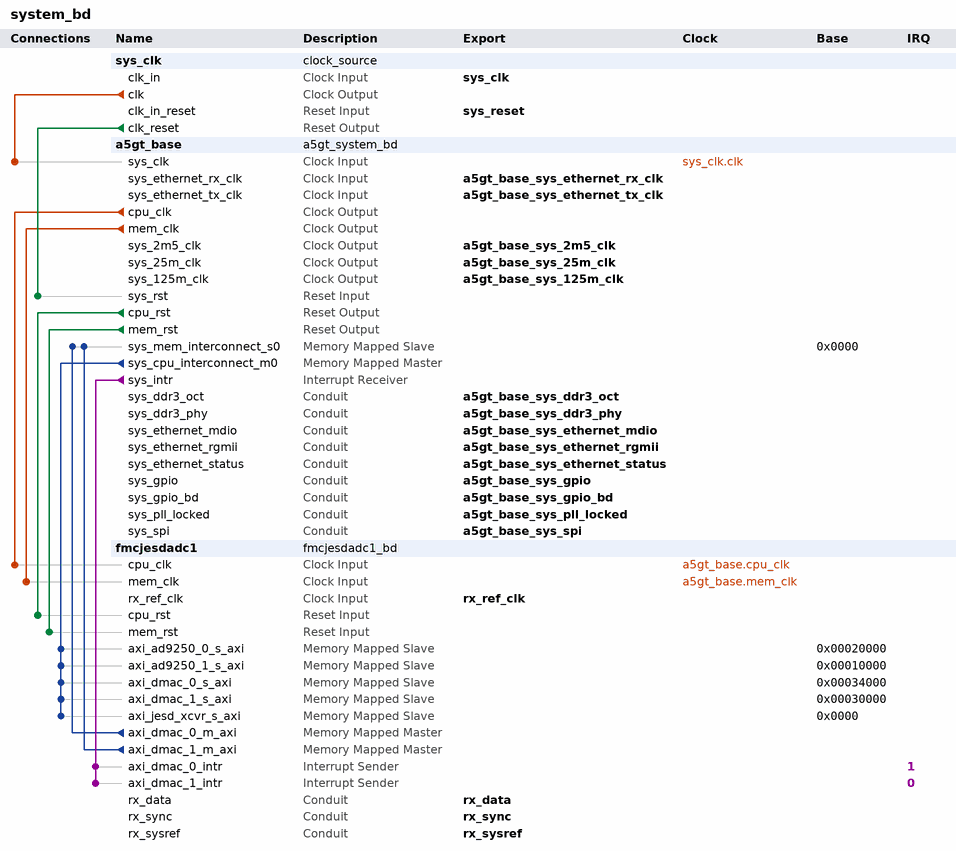
[diagram p0: system contents]
# Platform Designer (Qsys) system system_bd, Arria V 5AGTFD7K3F40I3
# Parameters at their usual value, and those the tool derives, are not listed.
package require -exact qsys 15.1
create_system system_bd
set_project_property DEVICE_FAMILY {Arria V}
set_project_property DEVICE 5AGTFD7K3F40I3

add_instance sys_clk clock_source 15.1
set_instance_parameter_value sys_clk clockFrequency 100000000

add_instance a5gt_base a5gt_system_bd 1.0

add_instance fmcjesdadc1 fmcjesdadc1_bd 1.0

# connections
add_connection a5gt_base.cpu_clk fmcjesdadc1.cpu_clk clock
add_connection a5gt_base.mem_clk fmcjesdadc1.mem_clk clock
add_connection sys_clk.clk a5gt_base.sys_clk clock
add_connection a5gt_base.cpu_rst fmcjesdadc1.cpu_rst reset
add_connection a5gt_base.mem_rst fmcjesdadc1.mem_rst reset
add_connection sys_clk.clk_reset a5gt_base.sys_rst reset
add_connection a5gt_base.sys_cpu_interconnect_m0 fmcjesdadc1.axi_ad9250_0_s_axi avalon
set_connection_parameter_value a5gt_base.sys_cpu_interconnect_m0/fmcjesdadc1.axi_ad9250_0_s_axi baseAddress 0x00020000
add_connection a5gt_base.sys_cpu_interconnect_m0 fmcjesdadc1.axi_ad9250_1_s_axi avalon
set_connection_parameter_value a5gt_base.sys_cpu_interconnect_m0/fmcjesdadc1.axi_ad9250_1_s_axi baseAddress 0x00010000
add_connection a5gt_base.sys_cpu_interconnect_m0 fmcjesdadc1.axi_dmac_0_s_axi avalon
set_connection_parameter_value a5gt_base.sys_cpu_interconnect_m0/fmcjesdadc1.axi_dmac_0_s_axi baseAddress 0x00034000
add_connection a5gt_base.sys_cpu_interconnect_m0 fmcjesdadc1.axi_dmac_1_s_axi avalon
set_connection_parameter_value a5gt_base.sys_cpu_interconnect_m0/fmcjesdadc1.axi_dmac_1_s_axi baseAddress 0x00030000
add_connection a5gt_base.sys_cpu_interconnect_m0 fmcjesdadc1.axi_jesd_xcvr_s_axi avalon
set_connection_parameter_value a5gt_base.sys_cpu_interconnect_m0/fmcjesdadc1.axi_jesd_xcvr_s_axi baseAddress 0x0000
add_connection fmcjesdadc1.axi_dmac_0_m_axi a5gt_base.sys_mem_interconnect_s0 avalon
set_connection_parameter_value fmcjesdadc1.axi_dmac_0_m_axi/a5gt_base.sys_mem_interconnect_s0 baseAddress 0x0000
add_connection fmcjesdadc1.axi_dmac_1_m_axi a5gt_base.sys_mem_interconnect_s0 avalon
set_connection_parameter_value fmcjesdadc1.axi_dmac_1_m_axi/a5gt_base.sys_mem_interconnect_s0 baseAddress 0x0000
add_connection a5gt_base.sys_intr fmcjesdadc1.axi_dmac_0_intr interrupt
set_connection_parameter_value a5gt_base.sys_intr/fmcjesdadc1.axi_dmac_0_intr irqNumber 1
add_connection a5gt_base.sys_intr fmcjesdadc1.axi_dmac_1_intr interrupt
set_connection_parameter_value a5gt_base.sys_intr/fmcjesdadc1.axi_dmac_1_intr irqNumber 0

# exported interfaces
add_interface a5gt_base_sys_125m_clk clock source
set_interface_property a5gt_base_sys_125m_clk EXPORT_OF a5gt_base.sys_125m_clk
add_interface a5gt_base_sys_25m_clk clock source
set_interface_property a5gt_base_sys_25m_clk EXPORT_OF a5gt_base.sys_25m_clk
add_interface a5gt_base_sys_2m5_clk clock source
set_interface_property a5gt_base_sys_2m5_clk EXPORT_OF a5gt_base.sys_2m5_clk
add_interface a5gt_base_sys_ddr3_oct conduit end
set_interface_property a5gt_base_sys_ddr3_oct EXPORT_OF a5gt_base.sys_ddr3_oct
add_interface a5gt_base_sys_ddr3_phy conduit end
set_interface_property a5gt_base_sys_ddr3_phy EXPORT_OF a5gt_base.sys_ddr3_phy
add_interface a5gt_base_sys_ethernet_mdio conduit end
set_interface_property a5gt_base_sys_ethernet_mdio EXPORT_OF a5gt_base.sys_ethernet_mdio
add_interface a5gt_base_sys_ethernet_rgmii conduit end
set_interface_property a5gt_base_sys_ethernet_rgmii EXPORT_OF a5gt_base.sys_ethernet_rgmii
add_interface a5gt_base_sys_ethernet_rx_clk clock sink
set_interface_property a5gt_base_sys_ethernet_rx_clk EXPORT_OF a5gt_base.sys_ethernet_rx_clk
add_interface a5gt_base_sys_ethernet_status conduit end
set_interface_property a5gt_base_sys_ethernet_status EXPORT_OF a5gt_base.sys_ethernet_status
add_interface a5gt_base_sys_ethernet_tx_clk clock sink
set_interface_property a5gt_base_sys_ethernet_tx_clk EXPORT_OF a5gt_base.sys_ethernet_tx_clk
add_interface a5gt_base_sys_gpio conduit end
set_interface_property a5gt_base_sys_gpio EXPORT_OF a5gt_base.sys_gpio
add_interface a5gt_base_sys_gpio_bd conduit end
set_interface_property a5gt_base_sys_gpio_bd EXPORT_OF a5gt_base.sys_gpio_bd
add_interface a5gt_base_sys_pll_locked conduit end
set_interface_property a5gt_base_sys_pll_locked EXPORT_OF a5gt_base.sys_pll_locked
add_interface a5gt_base_sys_spi conduit end
set_interface_property a5gt_base_sys_spi EXPORT_OF a5gt_base.sys_spi
add_interface rx_data conduit end
set_interface_property rx_data EXPORT_OF fmcjesdadc1.rx_data
add_interface rx_ref_clk clock sink
set_interface_property rx_ref_clk EXPORT_OF fmcjesdadc1.rx_ref_clk
add_interface rx_sync conduit end
set_interface_property rx_sync EXPORT_OF fmcjesdadc1.rx_sync
add_interface rx_sysref conduit end
set_interface_property rx_sysref EXPORT_OF fmcjesdadc1.rx_sysref
add_interface sys_clk clock sink
set_interface_property sys_clk EXPORT_OF sys_clk.clk_in
add_interface sys_reset reset sink
set_interface_property sys_reset EXPORT_OF sys_clk.clk_in_reset

set_interconnect_requirement {$system} qsys_mm.clockCrossingAdapter FIFO
set_interconnect_requirement {$system} qsys_mm.insertDefaultSlave false
set_interconnect_requirement {$system} qsys_mm.maxAdditionalLatency 2

save_system system_bd.qsys
